# EAGLE design magicke_oko (EAGLE 6.3)
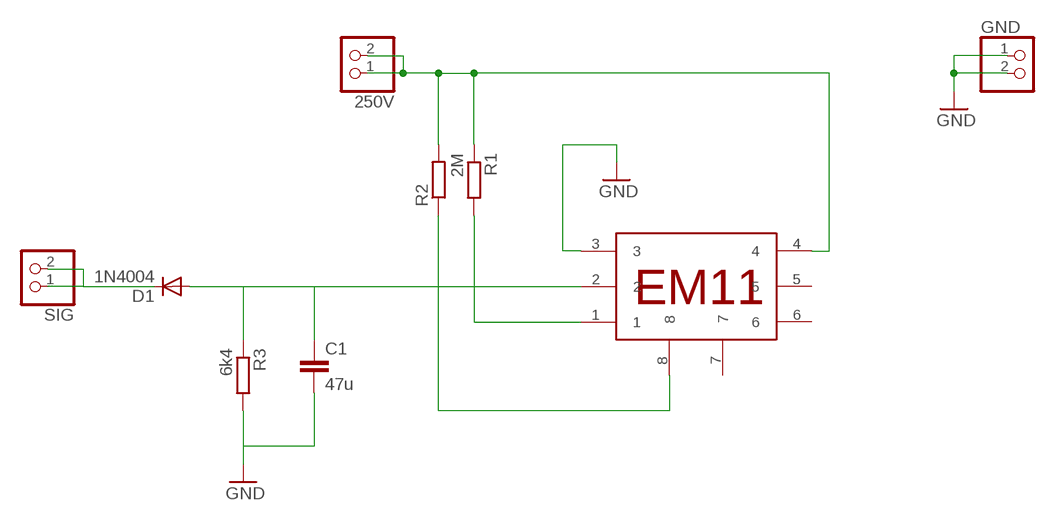
[diagram p0: schematic, sheet 1]

## Parts
250V  PINHD-1X2  [1X02]
C1  47u  C-EU050-075X075  [C050-075X075]
D1  1N4004  [DO41-10]
GND  PINHD-1X2  [1X02]
R1  2M  R-EU_0309/10  [0309/10]
R2  R-EU_0309/10  [0309/10]
R3  6k4  R-EU_0309/10  [0309/10]
SIG  PINHD-1X2  [1X02]
U$1  EM11  [EM11_PACKAGE]

## Nets
GND: C1.2 GND.1 GND.2 R3.2 U$1.3
N$1: R1.2 U$1.1
N$2: D1.C SIG.1 SIG.2
N$3: 250V.1 250V.2 R1.1 R2.2 U$1.4
N$5: C1.1 D1.A R3.1 U$1.2
N$6: R2.1 U$1.8
Unconnected: U$1.5 U$1.6 U$1.7

## Library data of the parts
250V GND SIG = pinhead:PINHD-1X2: PIN HEADER
C1 = rcl:C-EU: CAPACITOR, European symbol
D1 = diode:1N4004: DIODE general purpose rectifier, 1 A
R1-R3 = rcl:R-EU_: RESISTOR, European symbol
U$1 = elektronky:EM11

## Board
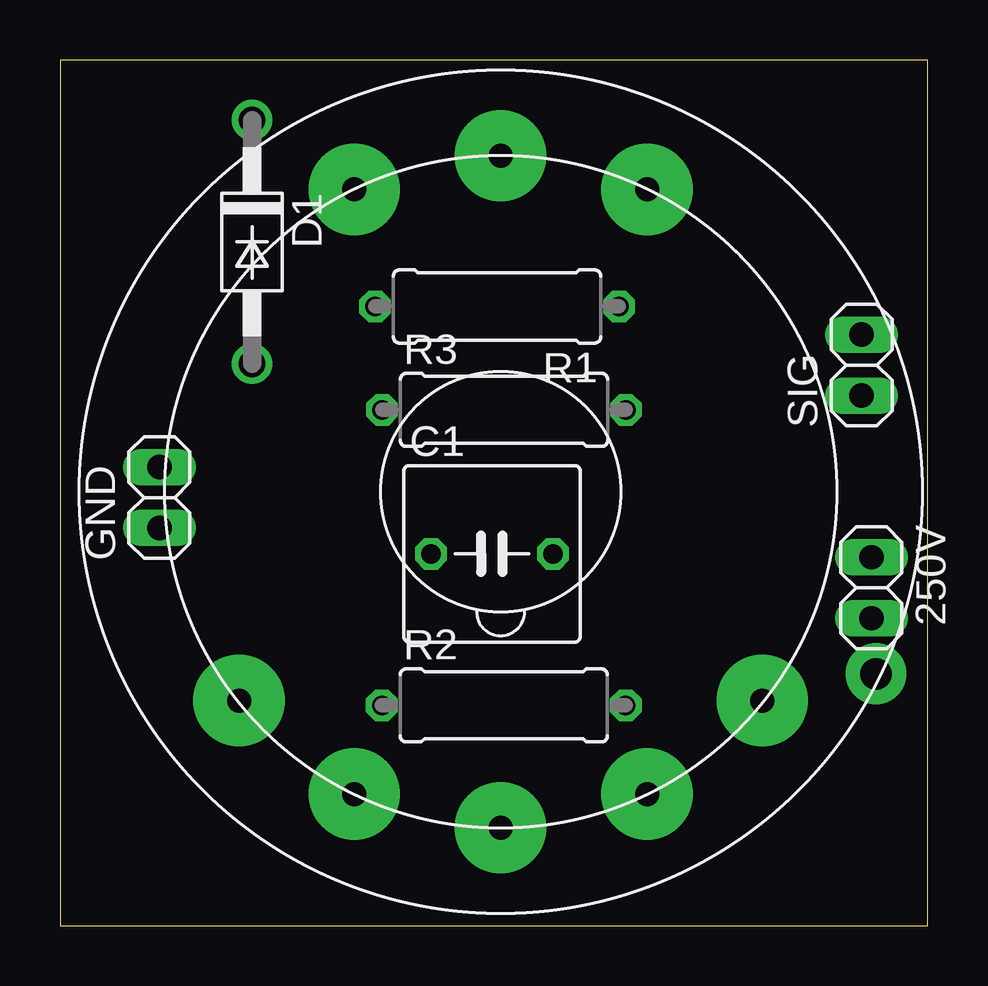
[diagram p1: board, top side]
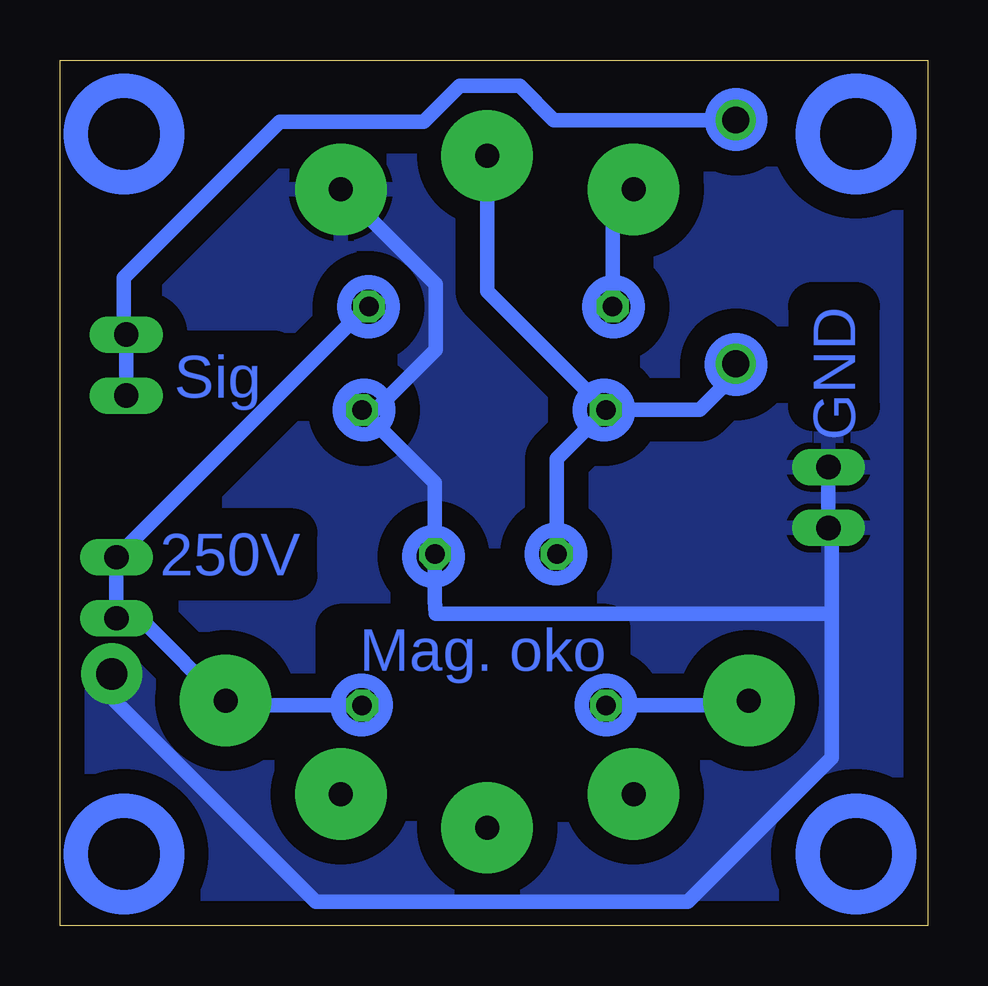
[diagram p2: board, bottom side, seen from below]

Size 36.16 x 36.08 mm. Coordinates in mm from the lower left corner, seen from the top.
Outline: 0,0 36.16,0 36.16,36.08 0,36.08 0,0
Copper layers (1*16): Top 0.035mm / dielectric 1.5mm / Bottom 0.035mm
Design rules "default": minimum track width 10mil, minimum drill 24mil, track to track 8mil, track to pad 8mil, pad to pad 8mil, via to via 8mil, smd to smd 8mil, copper to edge 40mil, drill to drill 8mil, minimum pad ring 10mil, minimum via ring 8mil, stop-mask expansion 4mil, vias tented up to drill 0mil, thermal gap 10mil

### Footprints (pad centres in the part's own frame; a part is rotated, then mirrored left to right if it is on the bottom)
1X02 = drill 1.016 long: 1 -1.27,0; 2 1.27,0
C050-075X075 = drill 0.813 octagon: 1 -2.54,0; 2 2.54,0
DO41-10 = drill 1.118: A 5.08,0; C -5.08,0
0309/10 = drill 0.813 octagon: 1 -5.08,0; 2 5.08,0
EM11_PACKAGE = drill 1 pad 3.81: 1 -6.1,12.6; 2 0,14; 3 6.1,12.6; 4 10.9,-8.7; 5 6.1,-12.6; 6 0,-14; 7 -6.1,-12.6; 8 -10.9,-8.7

### Placement (x,y rotation side)
250V  33.81,14.09 270 top
C1  18,15.5 0 top
D1  8,28.5 270 top
GND  4.14,17.85 90 top
R1  18.21,25.81 180 top
R2  18.49,9.19 0 top
R3  18.5,21.5 0 top
SIG  33.4,23.37 90 top
U$1  18.36,18.09 0 top

### Tracks (layer width: path | path; a pad name or v marks a point on that pad's centre or on a via)
GND  (via drill 1.3 pad 2.54)
  Bottom 0.61: v34,10.5 34,9.5 25.5,1 10,1 4,7 4,13 | 4,13 4,16.44 GND.1 GND.2 | U$1.3 20.5,26.73 20.5,24 23,21.5 R3.2 20.54,18.46 C1.2 20.54,13.54 20.5,13 4,13
  pour Bottom (isolate 1.016): 0,36 36,36 36,0 0,0
N$1
  Bottom 0.61: R1.2 13.13,30.69 U$1.1
N$2
  Bottom 0.61: D1.C 15.58,33.58 17,35 19.5,35 21,33.5 27,33.5 33.5,27 33.5,24.74 SIG.2 SIG.1
N$3
  Bottom 0.61: R2.2 29.06,9.19 U$1.4 29.39,9.39 32.5,12.5 33.49,12.5 250V.2 250V.1 23.36,25.81 R1.1
N$5
  Bottom 0.61: D1.A 8,23 9.5,21.5 R3.1 | C1.1 15.46,19.46 R3.1 | U$1.2 18.36,26.44 R3.1
N$6
  Bottom 0.61: R2.1 7.66,9.19 U$1.8
(copper drawn outside any net)
  shapes: Bottom circle x14

### Text on the board
Bottom: GND | Sig | 250V | Mag. oko